# EAGLE schematic Cherry_MX_Keyboard (EAGLE 7.7.0)
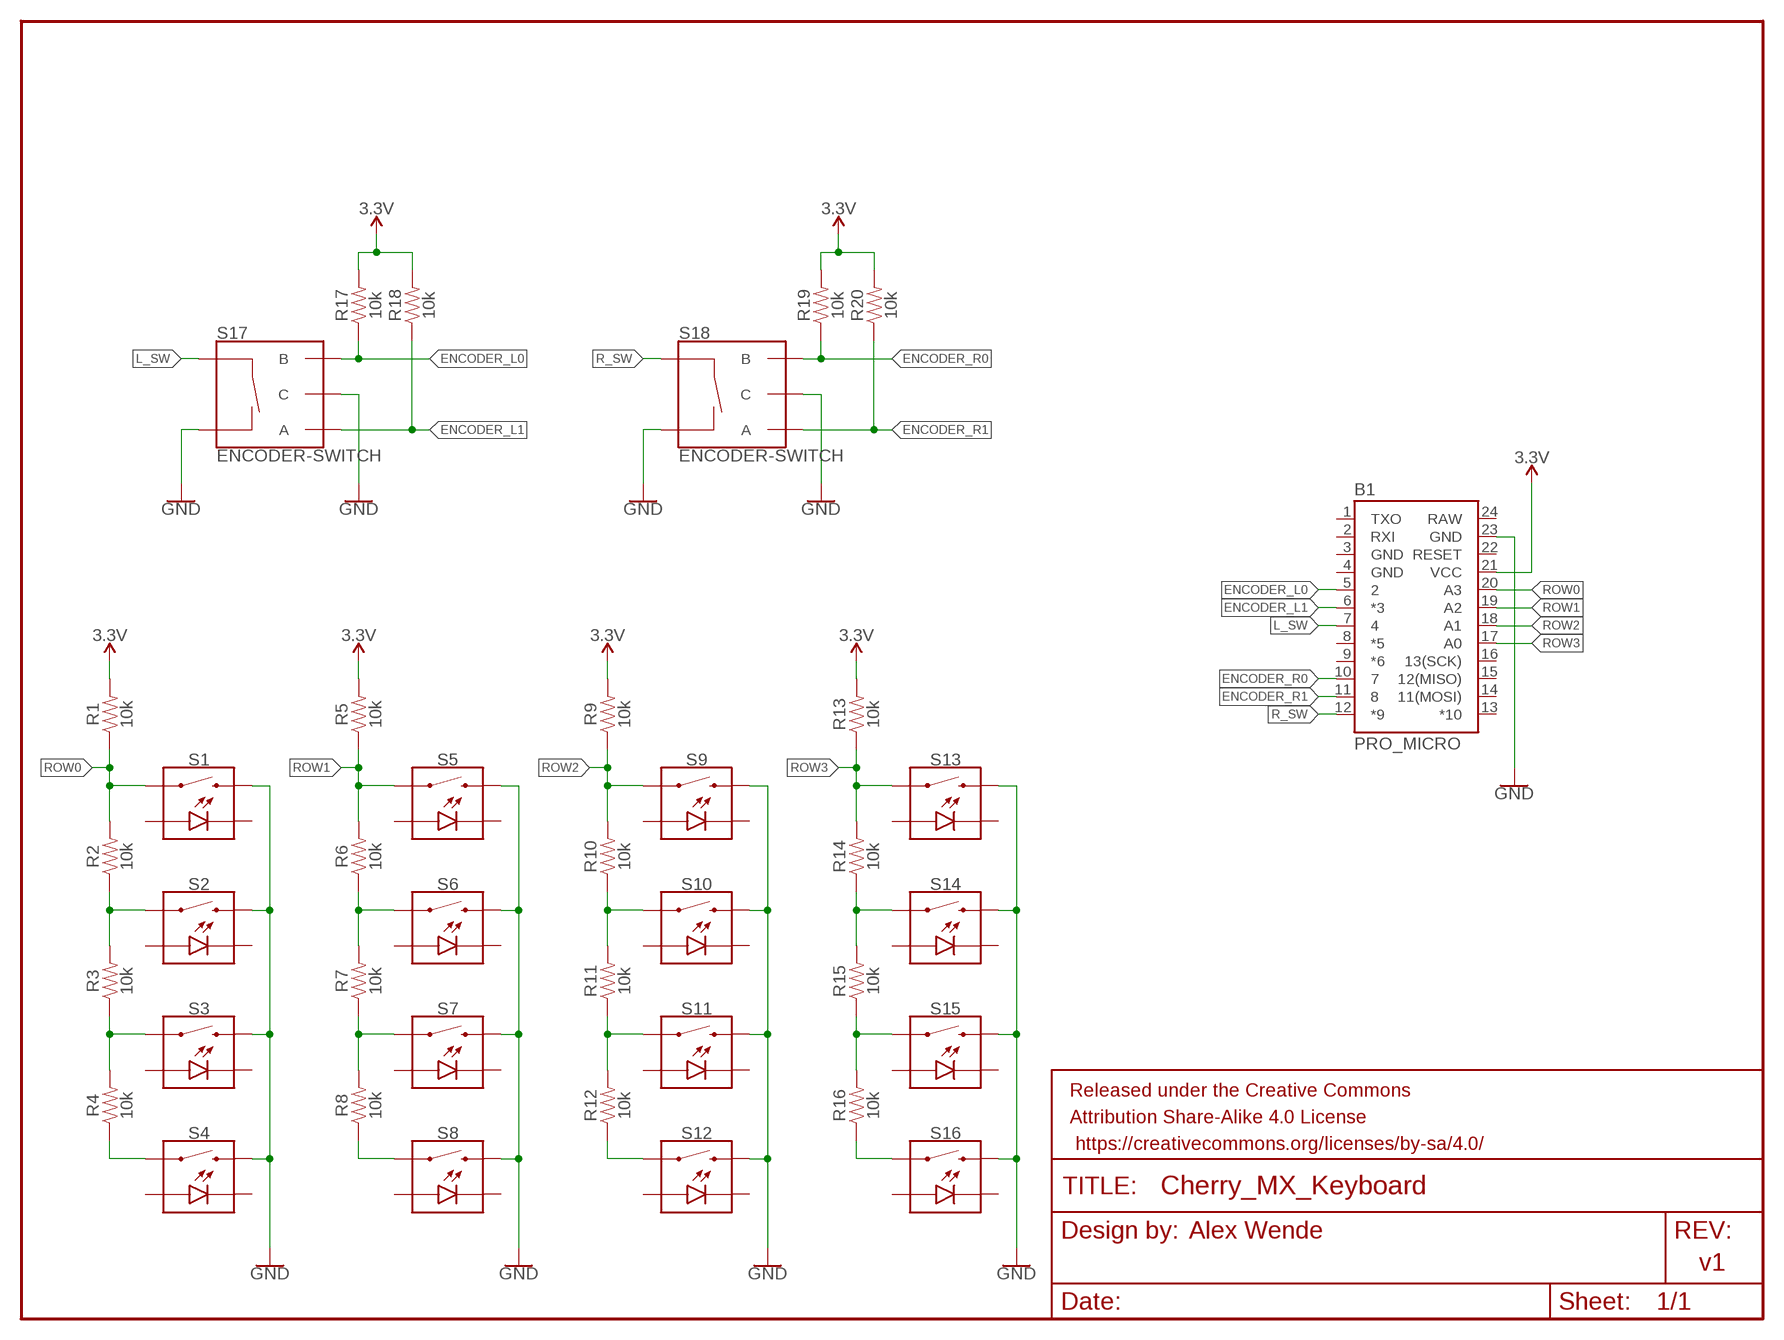
[diagram p0: schematic, sheet 1]

## Parts
B1  PRO_MICRO  SPARKFUN_PRO_MICRO  [SPARKFUN_PRO_MICRO]
FRAME1  FRAME-LETTERNO_PACKAGE  [DUMMY]
R1  10k  10KOHM-0603-1/10W-1%  [0603]
R2  10k  10KOHM-0603-1/10W-1%  [0603]
R3  10k  10KOHM-0603-1/10W-1%  [0603]
R4  10k  10KOHM-0603-1/10W-1%  [0603]
R5  10k  10KOHM-0603-1/10W-1%  [0603]
R6  10k  10KOHM-0603-1/10W-1%  [0603]
R7  10k  10KOHM-0603-1/10W-1%  [0603]
R8  10k  10KOHM-0603-1/10W-1%  [0603]
R9  10k  10KOHM-0603-1/10W-1%  [0603]
R10  10k  10KOHM-0603-1/10W-1%  [0603]
R11  10k  10KOHM-0603-1/10W-1%  [0603]
R12  10k  10KOHM-0603-1/10W-1%  [0603]
R13  10k  10KOHM-0603-1/10W-1%  [0603]
R14  10k  10KOHM-0603-1/10W-1%  [0603]
R15  10k  10KOHM-0603-1/10W-1%  [0603]
R16  10k  10KOHM-0603-1/10W-1%  [0603]
R17  10k  10KOHM-0603-1/10W-1%  [0603]
R18  10k  10KOHM-0603-1/10W-1%  [0603]
R19  10k  10KOHM-0603-1/10W-1%  [0603]
R20  10k  10KOHM-0603-1/10W-1%  [0603]
S1  MOMENTARY-SWITCH-SPST-LED-PTH-CHERRY  [CHERRY-MX-LED]
S2  MOMENTARY-SWITCH-SPST-LED-PTH-CHERRY  [CHERRY-MX-LED]
S3  MOMENTARY-SWITCH-SPST-LED-PTH-CHERRY  [CHERRY-MX-LED]
S4  MOMENTARY-SWITCH-SPST-LED-PTH-CHERRY  [CHERRY-MX-LED]
S5  MOMENTARY-SWITCH-SPST-LED-PTH-CHERRY  [CHERRY-MX-LED]
S6  MOMENTARY-SWITCH-SPST-LED-PTH-CHERRY  [CHERRY-MX-LED]
S7  MOMENTARY-SWITCH-SPST-LED-PTH-CHERRY  [CHERRY-MX-LED]
S8  MOMENTARY-SWITCH-SPST-LED-PTH-CHERRY  [CHERRY-MX-LED]
S9  MOMENTARY-SWITCH-SPST-LED-PTH-CHERRY  [CHERRY-MX-LED]
S10  MOMENTARY-SWITCH-SPST-LED-PTH-CHERRY  [CHERRY-MX-LED]
S11  MOMENTARY-SWITCH-SPST-LED-PTH-CHERRY  [CHERRY-MX-LED]
S12  MOMENTARY-SWITCH-SPST-LED-PTH-CHERRY  [CHERRY-MX-LED]
S13  MOMENTARY-SWITCH-SPST-LED-PTH-CHERRY  [CHERRY-MX-LED]
S14  MOMENTARY-SWITCH-SPST-LED-PTH-CHERRY  [CHERRY-MX-LED]
S15  MOMENTARY-SWITCH-SPST-LED-PTH-CHERRY  [CHERRY-MX-LED]
S16  MOMENTARY-SWITCH-SPST-LED-PTH-CHERRY  [CHERRY-MX-LED]
S17  ENCODER-SWITCH  [ROTARY_ENC_PLAIN]
S18  ENCODER-SWITCH  [ROTARY_ENC_PLAIN]

## Nets
3.3V: B1.21(VCC) R1.2 R5.2 R9.2 R13.2 R17.2 R18.2 R19.2 R20.2
ENCODER_L0: B1.5 R17.1 S17.B
ENCODER_L1: B1.6(*3) R18.1 S17.A
ENCODER_R0: B1.10 R19.1 S18.B
ENCODER_R1: B1.11 R20.1 S18.A
GND: B1.23(GND) S1.S2 S2.S2 S3.S2 S4.S2 S5.S2 S6.S2 S7.S2 S8.S2 S9.S2 S10.S2 S11.S2 S12.S2 S13.S2 S14.S2 S15.S2 S16.S2 S17.C S17.SW- S18.C S18.SW-
L_SW: B1.7 S17.SW+
N$1: R4.1 S4.S1
N$2: R3.1 R4.2 S3.S1
N$3: R2.1 R3.2 S2.S1
N$4: R8.1 S8.S1
N$5: R7.1 R8.2 S7.S1
N$6: R6.1 R7.2 S6.S1
N$7: R12.1 S12.S1
N$8: R11.1 R12.2 S11.S1
N$9: R10.1 R11.2 S10.S1
N$10: R16.1 S16.S1
N$11: R15.1 R16.2 S15.S1
N$12: R14.1 R15.2 S14.S1
R_SW: B1.12(*9) S18.SW+
ROW0: B1.20(A3) R1.1 R2.2 S1.S1
ROW1: B1.19(A2) R5.1 R6.2 S5.S1
ROW2: B1.18(A1) R9.1 R10.2 S9.S1
ROW3: B1.17(A0) R13.1 R14.2 S13.S1
Unconnected: B1.1(TXO) B1.2(RXI) B1.8(*5) B1.9(*6) B1.13(*10) B1.14(11(MOSI)) B1.15(12(MISO)) B1.16(13(SCK)) B1.22(RESET) S1.A S1.K(C) S2.A S2.K(C) S3.A S3.K(C) S4.A S4.K(C) S5.A S5.K(C) S6.A S6.K(C) S7.A S7.K(C) S8.A S8.K(C) S9.A S9.K(C) S10.A S10.K(C) S11.A S11.K(C) S12.A S12.K(C) S13.A S13.K(C) S14.A S14.K(C) S15.A S15.K(C) S16.A S16.K(C)

## Notes on the sheet
- Alex Wende
- v1

## Power pins joined to a net without a drawn wire
GND: B1.3(GND) B1.4(GND)
RAW: B1.24(RAW)

## Library data of the parts
B1 = SparkFun-Boards:SPARKFUN_PRO_MICRO: SparkFun Pro Micro Atmega32U4 compatible footprint. SparkFun Products: 3.3V/8MHz <https://www.sparkfun.com/products/12587> 5V/16MHz <https://www.sparkfun.com/products/12640>
FRAME1 = SparkFun-Aesthetics:FRAME-LETTER: Schematic Frame - Letter Standard 8.5x11 US Letter frame; DESIGNER: Nobody; VERSION: v01
R1-R20 = SparkFun-Resistors:10KOHM: 10kΩ resistor A resistor is a passive two-terminal electrical component that implements electrical resistance as a circuit element. Resistors act to reduce current flow, and, at the same time, act to lower voltage levels within circuits. - Wikipedia; PROD_ID: RES-00824
S1-S16 = SparkFun-Switches:MOMENTARY-SWITCH-SPST-LED: Momentary Switch (Pushbutton) - SPST - w/ LED Normally-open (NO) SPST momentary switches (buttons, pushbuttons), with a built-in LED. Variants PTH-CHERRY - Cherry MX Switch Cherry MX Keyswitches are top-of-the-line mechanical keyboard switches. They’re satisfyingly “clicky”, reliable up to tens-of-millions of key presses, and a standard in gaming and programming keyboards across the globe. This ‘blue’ version Cherry MX Switch is favored by most due to its secondary internal actuator making it less likely to “double-tap.” If you are looking for a noticeably audible and high-quality key switch, this is the perfect option for you! Cherry MX Switch <https://www.sparkfun.com/products/13834> (COM-13834) Cherry MX Switch Breakout <https://www.sparkfun.com/products/13773> (BOB-13773) PTH-12MM and PTH-12MM-KIT - 12mm Illuminated LED KIT variant is for soldering kits. There is no tStop (covering up the top side of the pads with mask). This helps the beginner see which side they should be soldering too. LED Tactile Button Breakout <https://www.sparkfun.com/products/10467> (BOB-10467) LED Tactile Button - Red <https://www.sparkfun.com/products/10442> (COM-10442) LED Tactile Button - Blue <https://www.sparkfun.com/products/10443> (COM-10443) LED Tactile Button - Green <https://www.sparkfun.com/products/10440> (COM-10440) LED Tactile Button - Orange <https://www.sparkfun.com/products/10441> (COM-10441) LED Tactile Button - White <https://www.sparkfun.com/products/10439> (COM-10439); SF_ID: COM-13834
S17 S18 = SparkFun-Switches:ENCODER-SWITCH: Rotary Encoder w/ Select Switch Encoders rotate similarly to potentiometers, but they’re different from potentiometers in that an encoder has full rotation without limits. They output gray code so that you can tell how much and in which direction the encoder has been turned. This encoder includes a push-down select switch built into the shaft. SparkFun Products Rotary Encoder <https://www.sparkfun.com/products/9117> (COM-09117); SF_SKU: COM-09117